# Altium schematic sheet Chip_Socket_Programmer-X01.SchDoc
size Letter; SheetNumber: 1; SheetTotal: 1
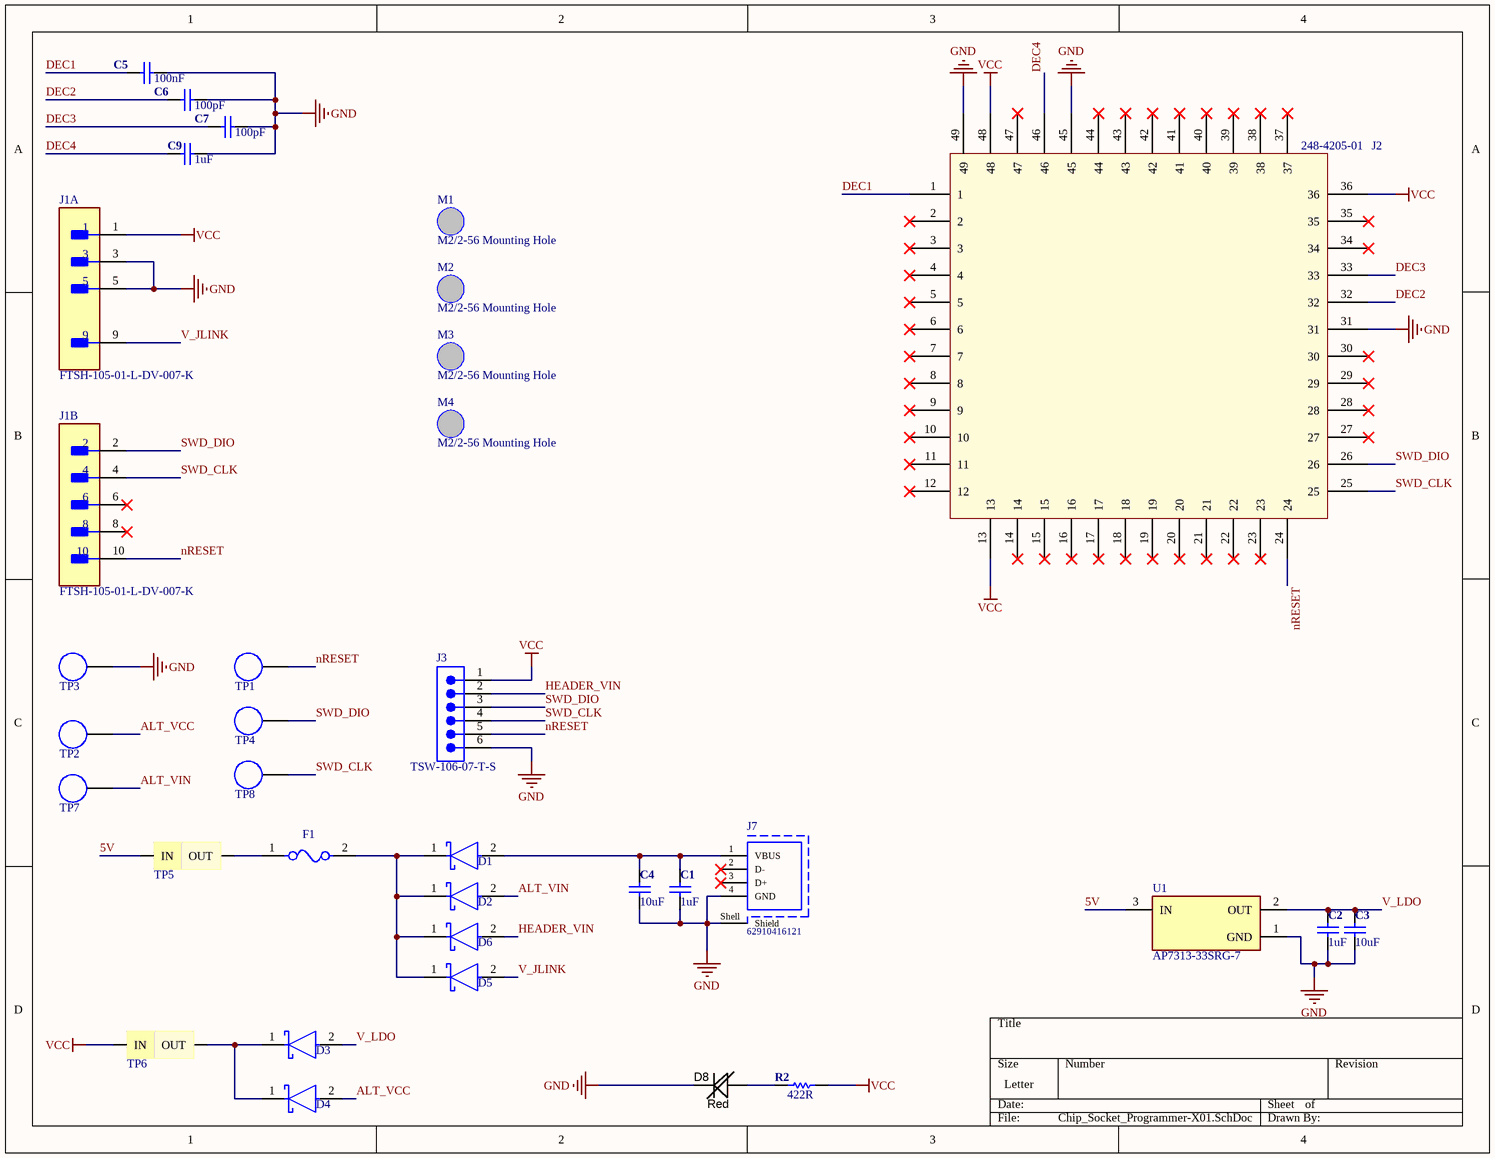
[diagram p0: Chip_Socket_Programmer-X01.SchDoc]

## Parts
C1  1uF  [C0402]
C2  1uF  [C0402]
C3  10uF  [C0402]
C4  10uF  [C0402]
C5  100nF  [C0402]
C6  100pF  [C0402]
C7  100pF  [C0402]
C9  1uF  [C0402]
D1  BAS140WE6327HTSA1  [FP-PG-SOD323-2-MFG]  (value not drawn)
D2  BAS140WE6327HTSA1  [FP-PG-SOD323-2-MFG]  (value not drawn)
D3  BAS140WE6327HTSA1  [FP-PG-SOD323-2-MFG]  (value not drawn)
D4  BAS140WE6327HTSA1  [FP-PG-SOD323-2-MFG]  (value not drawn)
D5  BAS140WE6327HTSA1  [FP-PG-SOD323-2-MFG]  (value not drawn)
D6  BAS140WE6327HTSA1  [FP-PG-SOD323-2-MFG]  (value not drawn)
D8  Red  [LED_0402]
F1  F0402G0R05FNTR  [FP-F0402G-MFG]  (value not drawn)
J1  FTSH-105-01-L-DV-007-K  [FTSH-105-01-L-DV-007-K]  (parts A,B of 2)
J2  248-4205-01  [248-4205-01]
J3  TSW-106-07-T-S  [SMTC-TSW-106-07-X-S]
J7  62910416121  [62910416121]
M1  M2/2-56 Mounting Hole  [Mounting Hole]
M2  M2/2-56 Mounting Hole  [Mounting Hole]
M3  M2/2-56 Mounting Hole  [Mounting Hole]
M4  M2/2-56 Mounting Hole  [Mounting Hole]
R2  422R  [R0402]
TP1  S1751-46R  [S1751-46R]  (value not drawn)
TP2  S1751-46R  [S1751-46R]  (value not drawn)
TP3  S1751-46R  [S1751-46R]  (value not drawn)
TP4  S1751-46R  [S1751-46R]  (value not drawn)
TP5  JUMPER  [JUMPER]  (value not drawn)
TP6  JUMPER  [JUMPER]  (value not drawn)
TP7  S1751-46R  [S1751-46R]  (value not drawn)
TP8  S1751-46R  [S1751-46R]  (value not drawn)
U1  AP7313-33SRG-7  [FP-SOT23-IPC_A]

## Nets
GND: C1.2 C2.2 C3.2 C4.2 C5.2 C6.2 C7.2 C9.1 D8.K J1.3 J1.5 J2.31 J2.45 J2.49 J3.6 J7.4(GND) J7.Shell(Shield) TP3.1 U1.1(GND)
VCC: J1.1 J2.13 J2.36 J2.48 J3.1 R2.1 TP6.1(IN)
5V: TP5.1(IN) U1.3(IN)
ALT_VCC: D4.2(A) TP2.1
ALT_VIN: D2.2(A) TP7.1
DEC1: C5.1 J2.1
DEC2: C6.1 J2.32
DEC3: C7.1 J2.33
DEC4: C9.2 J2.46
HEADER_VIN: D6.2(A) J3.2
nRESET: J1.10 J2.24 J3.5 TP1.1
SWD_CLK: J1.4 J2.25 J3.4 TP8.1
SWD_DIO: J1.2 J2.26 J3.3 TP4.1
V_JLINK: D5.2(A) J1.9
V_LDO: C2.1 C3.1 D3.2(A) U1.2(OUT)
NetC1_1: C1.1 C4.1 D1.2(A) J7.1(VBUS)
NetD1_1: D1.1(C) D2.1(C) D5.1(C) D6.1(C) F1.2
NetD3_1: D3.1(C) D4.1(C) TP6.2(OUT)
NetD8_A: D8.A R2.2
NetF1_1: F1.1 TP5.2(OUT)

Not connected (* = marked no-connect by the designer): J1 6* 8*; J2 2* 3* 4* 5* 6* 7* 8* 9* 10* 11* 12* 14* 15* 16* 17* 18* 19* 20* 21* 22* 23* 27* 28* 29* 30* 34* 35* 37* 38* 39* 40* 41* 42* 43* 44* 47*; J7 2(D-)* 3(D+)*

## Library data of the parts
C1 C2 C9 = C-0402(1005): Ceramic Capacitor, Multilayer, Ceramic, 6.3V, 20% +Tol, 20% -Tol, X5R, 15% TC, 1uF, Surface Mount, 0402; Manufacturer: Yageo; Manufacturer Part Number: CC0402MRX5R5BB105; Dissipation Factor: 10%; ComponentLink1URL: https://datasheet.ciiva.com/169/product-169683.pdf; ComponentLink1Description: https://datasheet.ciiva.com/169/product-169683.pdf; Supplier 1: Digi-Key; Supplier Part Number 1: 311-1441-1-ND; RoHS: Yes; Category: Ceramic Capacitors; Stock 1: 16697; Pricing 1: 1=0.13000, 10=0.08900, 100=0.04200, 500=0.02946, 1000=0.02439, 2500=0.02270, 5000=0.02076 (USD); Mount: Surface Mount; Case/Package: 0402; Number of Pins: 2; Case Code (Imperial): 0402; Case Code (Metric): 1005; Min Operating Temperature: -55°C; Max Operating Temperature: 85°C; Capacitance: 1uF; Tolerance: 20%; Voltage Rating: 6.3V; Voltage Rating (DC): 6.3V; Packaging: Tape and Reel; Package Quantity: 1; Dielectric: X5R; Termination: SMD/SMT; Composition: Ceramic; Length: 1mm; Height: 0.5mm; Width: 0.5mm; Thickness: 0.022inch; Depth: 0.5mm; Lead Free: Lead Free; Halogen Free: Halogen Free; ComponentLink2URL: https://datasheet.ciiva.com:443/pdfs/VipMasterIC/IC/YAGO/YAGO-S-A0006851646/YAGO-S-A0006851646-1.pdf?src-supplier=IHS+Markit; ComponentLink2Description: https://datasheet.ciiva.com:443/pdfs/VipMasterIC/IC/YAGO/YAGO-S-A0006851646/YAGO-S-A0006851646-1.pdf?src-supplier=IHS+Markit; ComponentLink3URL: https://datasheet.ciiva.com/176/mlccorderingcode-176806.pdf?src-supplier=Digi-Key; ComponentLink3Description: https://datasheet.ciiva.com/176/mlccorderingcode-176806.pdf?src-supplier=Digi-Key; ComponentLink4URL: https://datasheet.ciiva.com/176/mlccorderingcode-176807.pdf?src-supplier=Digi-Key; ComponentLink4Description: https://datasheet.ciiva.com/176/mlccorderingcode-176807.pdf?src-supplier=Digi-Key; ComponentLink5URL: https://datasheet.ciiva.com/176/mlccorderingcode-176808.pdf?src-supplier=Digi-Key; ComponentLink5Description: https://datasheet.ciiva.com/176/mlccorderingcode-176808.pdf?src-supplier=Digi-Key
C3 C4 = C-0402(1005): Ceramic Capacitor, Multilayer, Ceramic, 10V, 20% +Tol, 20% -Tol, X5R, 15% TC, 10uF, Surface Mount, 0402; Manufacturer: Kyocera AVX; Manufacturer Part Number: 0402ZD106MAT2A; Multilayer: Yes; Supplier 1: Digi-Key; Supplier Part Number 1: 478-10052-1-ND; RoHS: Yes; Category: Ceramic Capacitors; Stock 1: 113474; Pricing 1: 1=0.54000, 10=0.37400, 50=0.26160, 100=0.22420, 500=0.16818, 1000=0.14202, 2500=0.13455, 5000=0.12708 (USD); Mount: Surface Mount; Number of Pins: 2; Dielectric Material: Ceramic; Package Shape: Rectangular; Size Code: 0402; Terminal Finish: Nickel; Min Operating Temperature: -55°C; Max Operating Temperature: 85°C; JESD-609 Code: e3; Capacitance: 10uF; Capacitor Type: Ceramic; Negative Tolerance: 20%; Packaging: Tape and Reel; Positive Tolerance: 20%; Rated DC Voltage (URdc): 10V; Temperature Characteristics Code: X5R; Termination: Wraparound; REACH SVHC: Yes; RoHS Compliant: Yes; ComponentLink1URL: https://datasheet.ciiva.com:443/pdfs/VipMasterIC/IC/AVXC/AVXC-S-A0009640604/AVXC-S-A0009640604-1.pdf?src-supplier=IHS+Markit; ComponentLink1Description: https://datasheet.ciiva.com:443/pdfs/VipMasterIC/IC/AVXC/AVXC-S-A0009640604/AVXC-S-A0009640604-1.pdf?src-supplier=IHS+Markit; ComponentLink2URL: http://catalogs.avx.com/SurfaceMount.pdf?src-supplier=Digi-Key; ComponentLink2Description: http://catalogs.avx.com/SurfaceMount.pdf?src-supplier=Digi-Key; ComponentLink3URL: http://datasheets.avx.com/cx5r.pdf?src-supplier=Digi-Key; ComponentLink3Description: http://datasheets.avx.com/cx5r.pdf?src-supplier=Digi-Key; ComponentLink4URL: https://www.farnell.com/datasheets/2260752.pdf?src-supplier=Newark; ComponentLink4Description: https://www.farnell.com/datasheets/2260752.pdf?src-supplier=Newark
C5 = C-0402(1005): Ceramic Capacitor, Multilayer, Ceramic, 25V, 10% +Tol, 10% -Tol, X5R, 15% TC, 0.1uF, Surface Mount, 0402; Manufacturer: Taiyo Yuden; Manufacturer Part Number: TMK105BJ104KV-F; ComponentLink1URL: https://datasheet.ciiva.com/169/product-169683.pdf; ComponentLink1Description: https://datasheet.ciiva.com/169/product-169683.pdf; Supplier 1: Digi-Key; Supplier Part Number 1: 587-1456-1-ND; RoHS: Yes; Category: Ceramic Capacitors; Stock 1: 27456801; Pricing 1: 1=0.10000, 10=0.04600, 100=0.02050, 500=0.01464, 1000=0.01150, 2500=0.01045, 5000=0.00961 (USD); Mount: Surface Mount; Case/Package: 0402; Number of Pins: 2; Weight: 2.3E-05oz; Case Code (Imperial): 0402; Case Code (Metric): 1005; Min Operating Temperature: -55°C; Max Operating Temperature: 85°C; Capacitance: 100nF; Tolerance: 10%; Packaging: Tape and Reel; Dielectric: X5R; Voltage Rating (DC): 25V; Voltage Rating: 25V; Package Quantity: 1; Termination: SMD/SMT; Composition: Ceramic; Voltage: 25V; Length: 1mm; Height: 0.5mm; Width: 0.5mm; Depth: 0.5mm; Thickness: 0.022inch; REACH SVHC: No SVHC; Lead Free: Lead Free; Halogen Free: Halogen Free; ComponentLink2URL: https://datasheet.ciiva.com:443/pdfs/VipMasterIC/IC/TAIY/TAIY-S-A0009103435/TAIY-S-A0009103038-1.pdf?src-supplier=IHS+Markit; ComponentLink2Description: https://datasheet.ciiva.com:443/pdfs/VipMasterIC/IC/TAIY/TAIY-S-A0009103435/TAIY-S-A0009103038-1.pdf?src-supplier=IHS+Markit; ComponentLink3URL: https://datasheet.ciiva.com/30051/25tmk105bj104kv-f-30051094.pdf?src-supplier=Onlinecomponents.com; ComponentLink3Description: https://datasheet.ciiva.com/30051/25tmk105bj104kv-f-30051094.pdf?src-supplier=Onlinecomponents.com; ComponentLink4URL: https://datasheet.ciiva.com/15922/28tmk105bj104kv-f-15922315.pdf?src-supplier=Onlinecomponents.com; ComponentLink4Description: https://datasheet.ciiva.com/15922/28tmk105bj104kv-f-15922315.pdf?src-supplier=Onlinecomponents.com; ComponentLink5URL: https://datasheet.ciiva.com/131/tmk105bj104kv-f-ss-131420.pdf?src-supplier=Digi-Key; ComponentLink5Description: https://datasheet.ciiva.com/131/tmk105bj104kv-f-ss-131420.pdf?src-supplier=Digi-Key; ComponentLink6URL: https://datasheet.ciiva.com/22768/1693457-22768649.pdf?src-supplier=Farnell; ComponentLink6Description: https://datasheet.ciiva.com/22768/1693457-22768649.pdf?src-supplier=Farnell
C6 C7 = C-0402(1005): Ceramic Capacitor, Multilayer, Ceramic, 50V, 1% +Tol, 1% -Tol, C0G, 30ppm/Cel TC, 0.0001uF, Surface Mount, 0402; Manufacturer: Yageo; Manufacturer Part Number: CC0402FRNPO9BN101; ComponentLink1URL: https://datasheet.ciiva.com/169/product-169683.pdf; ComponentLink1Description: https://datasheet.ciiva.com/169/product-169683.pdf; Supplier 1: Digi-Key; Supplier Part Number 1: 311-3329-1-ND; RoHS: Yes; Category: Ceramic Capacitors; Stock 1: 22812; Pricing 1: 1=0.11000, 10=0.08200, 100=0.03840, 500=0.02690, 1000=0.02228, 2500=0.02073, 5000=0.01897 (USD); Mount: Surface Mount; Case/Package: 0402; Case Code (Imperial): 0402; Case Code (Metric): 1005; Min Operating Temperature: -55°C; Max Operating Temperature: 125°C; Package Quantity: 10000; Voltage Rating (DC): 50V; Dielectric: C0G; Termination: SMD/SMT; Composition: Ceramic; Packaging: Tape and Reel; Capacitance: 100pF; Tolerance: 1%; Voltage Rating: 50V; Length: 1mm; Width: 0.02inch; Thickness: 0.022inch; Depth: 0.5mm; Lead Free: Lead Free; ComponentLink2URL: https://datasheet.ciiva.com:443/pdfs/VipMasterIC/IC/YAGO/YAGO-S-A0009251638/YAGO-S-A0009251638-1.pdf?src-supplier=IHS+Markit; ComponentLink2Description: https://datasheet.ciiva.com:443/pdfs/VipMasterIC/IC/YAGO/YAGO-S-A0009251638/YAGO-S-A0009251638-1.pdf?src-supplier=IHS+Markit; ComponentLink3URL: http://www.mouser.com/ds/2/447/Yageo_UPY-GP_NP0_16V-to-50V_9-358835.pdf?src-supplier=Mouser; ComponentLink3Description: http://www.mouser.com/ds/2/447/Yageo_UPY-GP_NP0_16V-to-50V_9-358835.pdf?src-supplier=Mouser; ComponentLink4URL: http://components.arrow.com/part/dataview/0323_00775990?src-supplier=Arrow+Europe; ComponentLink4Description: http://components.arrow.com/part/dataview/0323_00775990?src-supplier=Arrow+Europe; ComponentLink5URL: http://www.yageo.com/NewPortal/yageodocoutput?fileName=/pdf/MLCC/UPY-GP_NP0_16V-to-50V_14.pdf&src-supplier=Digi-Key; ComponentLink5Description: http://www.yageo.com/NewPortal/yageodocoutput?fileName=/pdf/MLCC/UPY-GP_NP0_16V-to-50V_14.pdf&src-supplier=Digi-Key; ComponentLink6URL: http://www.yageo.com/documents/recent/UPY-GP_NP0_16V-to-50V_16.pdf?src-supplier=Digi-Key; ComponentLink6Description: http://www.yageo.com/documents/recent/UPY-GP_NP0_16V-to-50V_16.pdf?src-supplier=Digi-Key; ComponentLink7URL: http://www.yageo.com/documents/recent/UPY-GP_NP0_16V-to-50V_9.pdf?src-supplier=Future+Electronics; ComponentLink7Description: http://www.yageo.com/documents/recent/UPY-GP_NP0_16V-to-50V_9.pdf?src-supplier=Future+Electronics
D1-D6 = CMP-32890-000002-1: DIODE SCHOTTKY 40V 120MA SOD323; Manufacturer: Infineon; Peak Non-Repetitive Surge Current: 200mA; Forward Voltage: 1V; Reverse Recovery Time: 100ps; Element Configuration: Single; Diode Element Material: SILICON; Package Body Material: Plastic; Diode Type: RECTIFIER; Number of Elements: 1; Max Power Dissipation: 250mW; Qualification Status: Not Qualified; Min Operating Temperature: -55°C; Average Rectified Current: 120mA; Halogen Free: Not Halogen Free; Mount: Surface Mount; Max Reverse Voltage (DC): 40V; Case/Package: SOD-323-2; Packaging: Tape and Reel; Lead Free: Lead Free; Radiation Hardening: No; Number of Pins: 2; Forward Current: 120mA; Max Operating Temperature: 125°C; Max Repetitive Reverse Voltage (Vrrm): 40V; Supplier 1: Digi-Key; Supplier Part Number 1: BAS140WE6327HTSA1CT-ND; Manufacturer Part Number: BAS140WE6327HTSA1; RoHS: Yes; Category: Rectifier Diodes; Stock 1: 1828; Pricing 1: 1=0.55000, 10=0.41300, 100=0.25740, 500=0.17612, 1000=0.13547 (USD); Package Shape: Rectangular; Terminal Finish: Tin; JESD-609 Code: e3; JESD-30 Code: R-PDSO-G2; Moisture Sensitivity Level: 1; Package Style: SMALL OUTLINEMeter; Surface Mount: Yes; Technology: SCHOTTKY; Terminal Form: Gull Wing; Terminal Position: DUAL; Max Output Current: 120mA; REACH SVHC: Yes; RoHS Compliant: Yes; ComponentLink1URL: https://datasheet.ciiva.com:443/pdfs/VipMasterIC/IC/INFN/INFNS11688/INFNS11688-1.pdf?src-supplier=IHS+Markit; ComponentLink1Description: https://datasheet.ciiva.com:443/pdfs/VipMasterIC/IC/INFN/INFNS11688/INFNS11688-1.pdf?src-supplier=IHS+Markit; ComponentLink2URL: https://datasheet.ciiva.com/26851/getdatasheetpartid-730941-26851022.pdf?src-supplier=Verical; ComponentLink2Description: https://datasheet.ciiva.com/26851/getdatasheetpartid-730941-26851022.pdf?src-supplier=Verical; ComponentLink3URL: https://datasheet.ciiva.com/8303/infineon-bas40-bas140series-ds-v01-01-en-8303321.pdf?src-supplier=Avnet; ComponentLink3Description: https://datasheet.ciiva.com/8303/infineon-bas40-bas140series-ds-v01-01-en-8303321.pdf?src-supplier=Avnet
D8 = LED_0402(1005): Single Color LED, Hyper Red, Water Clear, 0.8mm; Manufacturer: Kingbright; Manufacturer Part Number: APHHS1005SURCK; Forward Current: 20mA; Forward Voltage: 1.95V; Luminous Intensity: 220mcd; Viewing Angle: 120°; Wavelength: 635nm; Lens Style: Clear,Flat; Dominant Wavelength: 630nm; Number of LEDs: 1; Supplier 1: Digi-Key; Supplier Part Number 1: 754-1104-1-ND; RoHS: Yes; Category: LEDs; Stock 1: 12156; Pricing 1: 1=0.50000, 10=0.35400, 100=0.20650, 500=0.14160, 1000=0.11800 (USD); Mount: Surface Mount; Case/Package: 0402; Number of Pins: 2; Color: Red; Case Code (Metric): 1005; Case Code (Imperial): 0402; Lens Color: Clear; Min Operating Temperature: -40°C; Max Operating Temperature: 85°C; Packaging: Tape and Reel; Package Quantity: 2000; Illumination Color: Red; Test Current: 20mA; Length: 1mm; Height: 0.6mm; Width: 0.5mm; Lead Free: Lead Free; ComponentLink1URL: https://datasheet.ciiva.com:443/pdfs/VipMasterIC/IC/KBEC/KBEC-S-A0008947180/KBEC-S-A0008958151-1.pdf?src-supplier=IHS+Markit; ComponentLink1Description: https://datasheet.ciiva.com:443/pdfs/VipMasterIC/IC/KBEC/KBEC-S-A0008947180/KBEC-S-A0008958151-1.pdf?src-supplier=IHS+Markit; ComponentLink2URL: https://datasheet.ciiva.com/4689/aphhs1005surck-32322-4689068.pdf?src-supplier=Mouser; ComponentLink2Description: https://datasheet.ciiva.com/4689/aphhs1005surck-32322-4689068.pdf?src-supplier=Mouser; ComponentLink3URL: https://datasheet.ciiva.com/2114/aphhs1005surck-2114140.pdf?src-supplier=Digi-Key; ComponentLink3Description: https://datasheet.ciiva.com/2114/aphhs1005surck-2114140.pdf?src-supplier=Digi-Key; ComponentLink4URL: https://datasheet.ciiva.com/14603/70062833-14603899.pdf?src-supplier=Allied+Electronics; ComponentLink4Description: https://datasheet.ciiva.com/14603/70062833-14603899.pdf?src-supplier=Allied+Electronics; ComponentLink5URL: https://datasheet.ciiva.com/2114/aphhs1005surck-2114142.pdf?src-supplier=Digi-Key; ComponentLink5Description: https://datasheet.ciiva.com/2114/aphhs1005surck-2114142.pdf?src-supplier=Digi-Key; ComponentLink6URL: https://datasheet.ciiva.com/2114/aphhs1005surck-2114141.pdf?src-supplier=Digi-Key; ComponentLink6Description: https://datasheet.ciiva.com/2114/aphhs1005surck-2114141.pdf?src-supplier=Digi-Key
F1 = CMP-04585-000002-1: FUSE BOARD MOUNT 50MA 32VDC 0402; Manufacturer: AVX Corporation; Fuse Blow Speed: Fast; Resistance: 3.4Ω; Value: 3.4Ω; Voltage Rating: 32V; Fuse Voltage Drop: 250mV; Circuit Protection Type: Electric Fuse; Joule-integral-Nom: 0J; Lead Free: Yes; Fuse Current: 50mA; Device Class L2: Fuses; ComponentLink2URL: http://datasheets.avx.com/AccuGuardLC_0402.pdf; Automotive: No; Digikey Description: FUSE BOARD MOUNT 50MA 32VDC 0402; Temperature Range Low: -55°C; Device Class L1: Circuit Protection; Octopart: https://octopart.com/f0402g0r05fntr-avx-19631750; ComponentLink2Description: Datasheet; Mouser Description: Surface Mount Fuses 0402 50mA fuse; Device Class L3: unset; Temperature Range High: +125°C; Manufacturer Part Number: F0402G0R05FNTR; Height: 0.4mm; Package: F0402G; RoHS: TRUE; Temperature: -55°C to +125°C; Category: Fuse; Supplier 1: Digi-Key; Supplier Part Number 1: 478-6482-1-ND; Stock 1: 222662; Pricing 1: 1=0.80000, 5=0.78000, 10=0.75600, 50=0.63600, 100=0.52800, 250=0.48000, 500=0.40800, 1000=0.36000 (USD); Mount: Surface Mount; Terminal Finish: Nickel; Min Operating Temperature: -55°C; Max Operating Temperature: 125°C; Current Rating: 50mA; Voltage Rating (AC): 32V; Voltage Rating (DC): 32V; JESD-609 Code: e3; REACH SVHC: Yes; RoHS Compliant: Yes; ComponentLink1URL: https://datasheet.ciiva.com:443/pdfs/VipMasterIC/IC/AVXC/AVXCS07889/AVXCS07889-1.pdf?src-supplier=IHS+Markit; ComponentLink1Description: https://datasheet.ciiva.com:443/pdfs/VipMasterIC/IC/AVXC/AVXCS07889/AVXCS07889-1.pdf?src-supplier=IHS+Markit; ComponentLink3URL: https://datasheet.ciiva.com/4485/accug2minilc-38833-4485751.pdf?src-supplier=Mouser; ComponentLink3Description: https://datasheet.ciiva.com/4485/accug2minilc-38833-4485751.pdf?src-supplier=Mouser; ComponentLink4URL: https://datasheet.ciiva.com/301/accug2minilc-301366.pdf?src-supplier=Digi-Key; ComponentLink4Description: https://datasheet.ciiva.com/301/accug2minilc-301366.pdf?src-supplier=Digi-Key; ComponentLink5URL: https://datasheet.ciiva.com/301/accug2minilc-301367.pdf?src-supplier=Digi-Key; ComponentLink5Description: https://datasheet.ciiva.com/301/accug2minilc-301367.pdf?src-supplier=Digi-Key; ComponentLink6URL: https://datasheet.ciiva.com/301/accug2minilc-301368.pdf?src-supplier=Digi-Key; ComponentLink6Description: https://datasheet.ciiva.com/301/accug2minilc-301368.pdf?src-supplier=Digi-Key; ComponentLink7URL: https://datasheet.ciiva.com/17417/accug2minilc-17417929.pdf?src-supplier=Avnet+Europe; ComponentLink7Description: https://datasheet.ciiva.com/17417/accug2minilc-17417929.pdf?src-supplier=Avnet+Europe; ComponentLink8URL: https://datasheet.ciiva.com/3017/accug2minilc-3017725.pdf?src-supplier=Avnet; ComponentLink8Description: https://datasheet.ciiva.com/3017/accug2minilc-3017725.pdf?src-supplier=Avnet
J1 = 7c368be3265735b2816d0cab4417f87: CONN HEADER SMD 10POS 1.27MM; Manufacturer: Samtec; Connector Type: Male Pin; Number of Positions: 10; Number of Positions Loaded: 9; Current Rating: 3.4A; Supplier 1: Digi-Key; Supplier Part Number 1: SAM9438-ND; Manufacturer Part Number: FTSH-105-01-L-DV-007-K; RoHS: No; Category: Headers and Wire Housings; Pricing 1: 1=3.43000, 10=3.28800, 100=2.74000, 500=2.32900, 1000=1.98650, 5000=1.78100 (USD); Mount: Surface Mount; Number of Pins: 10; Contact Plating: Gold; Contact Material: Bronze; Contact Shape: Square; Insulation Material: Polymer; Insulation Color: Black; Min Operating Temperature: -55°C; Max Operating Temperature: 125°C; Fastening Type: Push,Pull; Packaging: Rail/Tube; Number of Rows: 2; Termination: Solder; Flammability Rating: UL94 V-0; ComponentLink1URL: https://datasheet.ciiva.com:443/pdfs/VipMasterIC/IC/SAMI/SAMI-S-A0006911451/SAMI-S-A0006911451-1.pdf?src-supplier=IHS+Markit; ComponentLink1Description: https://datasheet.ciiva.com:443/pdfs/VipMasterIC/IC/SAMI/SAMI-S-A0006911451/SAMI-S-A0006911451-1.pdf?src-supplier=IHS+Markit; ComponentLink2URL: http://www.farnell.com/datasheets/2570365.pdf?src-supplier=Farnell; ComponentLink2Description: http://www.farnell.com/datasheets/2570365.pdf?src-supplier=Farnell; ComponentLink3URL: http://suddendocs.samtec.com/prints/ftsh-1xx-xx-xxx-dv-xxx-xxx-mkt.pdf?src-supplier=Digi-Key; ComponentLink3Description: http://suddendocs.samtec.com/prints/ftsh-1xx-xx-xxx-dv-xxx-xxx-mkt.pdf?src-supplier=Digi-Key; ComponentLink4URL: http://www.farnell.com/datasheets/2570365.pdf?src-supplier=Element14; ComponentLink4Description: http://www.farnell.com/datasheets/2570365.pdf?src-supplier=Element14; ComponentLink5URL: http://www.farnell.com/datasheets/2570365.pdf?src-supplier=Newark; ComponentLink5Description: http://www.farnell.com/datasheets/2570365.pdf?src-supplier=Newark
J2 = 248-4205-01: IC Socket; Manufacturer: 3M; Supplier 1: Digi-Key; Supplier Part Number 1: 3M10836-ND; Manufacturer Part Number: 248-4205-01; RoHS: Yes; Category: IC and Component Sockets; Stock 1: 14; Pricing 1: 1=116.49000, 10=109.64200, 25=106.21520, 50=99.36260, 100=93.88060 (USD); Contact Finish - Mating: NOT SPECIFIED; Device Socket Type: IC SOCKET; REACH SVHC: No SVHC; RoHS Compliant: Yes; ComponentLink1URL: https://datasheet.ciiva.com:443/pdfs/VipMasterIC/IC/IIIM/IIIMS02795/IIIMS02795-1.pdf?src-supplier=IHS+Markit; ComponentLink1Description: https://datasheet.ciiva.com:443/pdfs/VipMasterIC/IC/IIIM/IIIMS02795/IIIMS02795-1.pdf?src-supplier=IHS+Markit; ComponentLink2URL: https://datasheet.ciiva.com/6783/cd2451-6783172.pdf?src-supplier=Digi-Key; ComponentLink2Description: https://datasheet.ciiva.com/6783/cd2451-6783172.pdf?src-supplier=Digi-Key; ComponentLink3URL: https://datasheet.ciiva.com/12084/cd2451-52150-12084009.pdf?src-supplier=Mouser; ComponentLink3Description: https://datasheet.ciiva.com/12084/cd2451-52150-12084009.pdf?src-supplier=Mouser; ComponentLink4URL: https://datasheet.ciiva.com/1102/cd2451-1102403.pdf?src-supplier=Newark; ComponentLink4Description: https://datasheet.ciiva.com/1102/cd2451-1102403.pdf?src-supplier=Newark; ComponentLink5URL: https://datasheet.ciiva.com/8006/cd2451-8006713.pdf?src-supplier=Element14; ComponentLink5Description: https://datasheet.ciiva.com/8006/cd2451-8006713.pdf?src-supplier=Element14
J3 = CMP-1024-00384-1: 0.025" SQ Post Header, Through-hole, Vertical, -55 to 105 degC, 2.54 mm Pitch, 6-Pin, Male, RoHS; Manufacturer: Samtec; Pitch: 2.54 mm; ComponentLink3URL: http://www.samtec.com/documents/webfiles/cpdf/TSW-XXX-XX-XXX-X-XX-XXX-MKT.pdf; ComponentLink1Description: Manufacturer URL; Orientation: Vertical; ComponentLink2Description: Datasheet; ComponentLink1URL: http://www.samtec.com; RoHS: True; DatasheetVersion: F-214; PackageDescription: .025[0.64] SQ. Post Terminal Strip Assembly; PartNumber: TSW-106-07-T-S; Mounting Technology: Through-hole; PackageReference: TSW-106-07-X-S; PackageVersion: DM, 8/1988; ComponentLink3Description: Package Specification; ComponentLink2URL: http://www.samtec.com/documents/webfiles/pdf/TSW_TH.PDF; Temperature Range: -55 to 105 degC
J7 = CMP-1502-03244-1: USB 2.0 Type B Receptacle WR-COM, Horizontal, SMT, with Pads and Pegs; Manufacturer: Wurth Electronics; Number of Contacts: 4; USB Standard: USB 2.0; Number of Ports: 1; Current Rating: 1.5A; Mating Cycles: 1500; Shielding: Shielded; Supplier 1: Digi-Key; Supplier Part Number 1: 732-3152-1-ND; Manufacturer Part Number: 62910416121; RoHS: Yes; Category: Connectors; Stock 1: 80; Pricing 1: 1=3.83000, 10=3.76300, 50=3.49400, 100=3.22600 (USD); Mount: Surface Mount; Contact Plating: Gold; Contact Material: Copper Alloy; Insulation Color: Black; Min Operating Temperature: -40°C; Max Operating Temperature: 105°C; Package Quantity: 150; Packaging: Tape and Reel; Gender: Receptacle; Connector Type: USB; Termination: Solder; Orientation: Right Angle; Features: Shielded; Length: 16mm; REACH SVHC: Unknown; Lead Free: Lead Free; Flammability Rating: UL94 V-0; ComponentLink1URL: https://datasheet.ciiva.com:443/pdfs/VipMasterIC/IC/MIDC/MIDC-S-A0004022663/MIDC-S-A0003061583-1.pdf?src-supplier=IHS+Markit; ComponentLink1Description: https://datasheet.ciiva.com:443/pdfs/VipMasterIC/IC/MIDC/MIDC-S-A0004022663/MIDC-S-A0003061583-1.pdf?src-supplier=IHS+Markit; ComponentLink2URL: https://datasheet.ciiva.com/851/62910416121-851244.pdf?src-supplier=Digi-Key; ComponentLink2Description: https://datasheet.ciiva.com/851/62910416121-851244.pdf?src-supplier=Digi-Key; ComponentLink3URL: https://datasheet.ciiva.com/851/62910416121-851245.pdf?src-supplier=Digi-Key; ComponentLink3Description: https://datasheet.ciiva.com/851/62910416121-851245.pdf?src-supplier=Digi-Key; ComponentLink4URL: https://datasheet.ciiva.com/851/62910416121-851246.pdf?src-supplier=Digi-Key; ComponentLink4Description: https://datasheet.ciiva.com/851/62910416121-851246.pdf?src-supplier=Digi-Key
R2 = R-0402(1005): Fixed Resistor, Thin Film, 0.0625W, 422ohm, 50V, 0.1% +/-Tol, 25ppm/Cel, Surface Mount, 0402; Manufacturer: Yageo; Manufacturer Part Number: RT0402BRD07422RL; Power Rating: 62.5mW; Temperature Coefficient: 25ppm/°C; Supplier 1: Digi-Key; Supplier Part Number 1: YAG4263CT-ND; RoHS: Yes; Category: Chip SMD Resistors; Stock 1: 9302; Pricing 1: 1=0.39000, 10=0.27800, 100=0.11140, 1000=0.05488, 2500=0.05084, 5000=0.04600 (USD); Case/Package: 0402; Case Code (Metric): 1005; Case Code (Imperial): 0402; Min Operating Temperature: -55°C; Max Operating Temperature: 125°C; Voltage Rating: 50V; Resistance: 422R; Tolerance: 0.1%; Packaging: Tape and Reel; Termination: SMD/SMT; Voltage Rating (DC): 50V; Length: 1mm; Height: 350um; Width: 500um; Lead Free: Lead Free; ComponentLink1URL: https://datasheet.ciiva.com:443/pdfs/VipMasterIC/IC/YAGO/YAGO-S-A0008510989/YAGO-S-A0008510989-1.pdf?src-supplier=IHS+Markit; ComponentLink1Description: https://datasheet.ciiva.com:443/pdfs/VipMasterIC/IC/YAGO/YAGO-S-A0008510989/YAGO-S-A0008510989-1.pdf?src-supplier=IHS+Markit; ComponentLink2URL: https://datasheet.ciiva.com/12705/pyu-rt-1-to-0-05-rohs-l-4-12705867.pdf?src-supplier=Mouser; ComponentLink2Description: https://datasheet.ciiva.com/12705/pyu-rt-1-to-0-05-rohs-l-4-12705867.pdf?src-supplier=Mouser
TP1-TP4 TP7 TP8 = S1751-46R: PC TEST POINT TIN SMD; Manufacturer: Harwin Inc.; Supplier 1: Digi-Key; RoHS: RoHS Compliant; Stock 1: 275112; Pricing 1: 1=0.29, 10=0.272, 25=0.2324, 50=0.2032, 100=0.1888, 250=0.167, 500=0.15972, 1000=0.13068 (USD); Packaging: Cut Tape (CT); Type: PC Test Point; Terminal: 0.128" x 0.065" x 0.079" (3.25mm x 1.65mm x 2.00mm) Brass, Tin Plated; Mounting Type: Surface Mount; Material: Copper Alloy; Color: Natural; ComponentLink1URL: http://cdn.harwin.com/pdfs/S1751.pdf; ComponentLink1Description: http://cdn.harwin.com/pdfs/S1751.pdf; Supplier Part Number 1: 952-1478-1-ND; Manufacturer Part Number: S1751-46R; Category: Test and Measurement
TP5 TP6 = JUMPER: SHUNT LP W/HANDLE 2 POS 30AU; Manufacturer: TE Connectivity; Manufacturer Part Number: 8815452; Number of Contacts: 2; Contact Current Rating: 3A; Contact Resistance: 15mR; Gender: Female; Pitch: 2.54mm; Approvals: UL,CSA; Supplier 1: Digi-Key; Supplier Part Number 1: A26242-ND; RoHS: Yes; Category: Headers and Wire Housings; Stock 1: 2099; Pricing 1: 1=0.280000, 10=0.262000, 25=0.223600, 50=0.195600, 100=0.181700, 250=0.160760, 500=0.153760, 1000=0.125800, 2500=0.115320 (USD); Contact Plating: Gold; Housing Color: Black; Housing Material: Thermoplastic; Contact Material: Bronze; Color: Black; Min Operating Temperature: -65°C; Max Operating Temperature: 105°C; Number of Rows: 1; Package Quantity: 14000; Packaging: Bag; Orientation: Straight; Number of Positions: 2; Contact Gender: Female; Current Rating: 3A; Termination: Solder; Length: 5.08mm; Height: 10.9mm; Depth: 10.9mm; Width: 2.5mm; Radiation Hardening: No; Flammability Rating: UL94 V-0; REACH SVHC: No SVHC; ComponentLink1URL: https://datasheet.ciiva.com/1455/92946-1455888.pdf?src-supplier=Newark; ComponentLink1Description: https://datasheet.ciiva.com/1455/92946-1455888.pdf?src-supplier=Newark; ComponentLink2URL: https://datasheet.ciiva.com/19459/841467-19459897.pdf?src-supplier=Jameco; ComponentLink2Description: https://datasheet.ciiva.com/19459/841467-19459897.pdf?src-supplier=Jameco; ComponentLink3URL: https://datasheet.ciiva.com/15174/getdatasheetpartid-155768-15174939.pdf?src-supplier=Verical; ComponentLink3Description: https://datasheet.ciiva.com/15174/getdatasheetpartid-155768-15174939.pdf?src-supplier=Verical; ComponentLink4URL: https://datasheet.ciiva.com/11754/0900766b80da19e8-11754990.pdf?src-supplier=RSComponents; ComponentLink4Description: https://datasheet.ciiva.com/11754/0900766b80da19e8-11754990.pdf?src-supplier=RSComponents; ComponentLink5URL: https://datasheet.ciiva.com/30154/eng-cs-1307819-section-6-7and8-0808-30154293.pdf?src-supplier=Onlinecomponents.com; ComponentLink5Description: https://datasheet.ciiva.com/30154/eng-cs-1307819-section-6-7and8-0808-30154293.pdf?src-supplier=Onlinecomponents.com; ComponentLink6URL: https://datasheet.ciiva.com/767/eng-cd-881545-k3-767850.pdf?src-supplier=Digi-Key; ComponentLink6Description: https://datasheet.ciiva.com/767/eng-cd-881545-k3-767850.pdf?src-supplier=Digi-Key; ComponentLink7URL: https://datasheet.ciiva.com/3120/eng-cs-1307819-section-6-7and8-0808-3120202.pdf?src-supplier=Avnet; ComponentLink7Description: https://datasheet.ciiva.com/3120/eng-cs-1307819-section-6-7and8-0808-3120202.pdf?src-supplier=Avnet
U1 = CMP-12756-000034-1: IC REG LIN 3.3V 150MA SOT23R-3; Manufacturer: Diodes; Number of Outputs: 1; Accuracy: 2%; Dropout Voltage: 150mV; Max Input Voltage: 6V; Output Type: Fixed; Polarity: Positive; Min Current Limit: 200mA; Min Input Voltage: 2V; Max Power Dissipation: 600mW; Power Dissipation: 540W; Quiescent Current: 75uA; Package Body Material: Plastic; Output Voltage1-Max: 3.366V; Output Voltage1-Min: 3.234V; Regulator Type: FIXED POSITIVE SINGLE OUTPUT LDO REGULATOR; Dropout Voltage1-Max: 300mV; Time @ Peak Reflow Temperature-Max (s): 30s; Qualification Status: Not Qualified; Case/Package: TO-236-3; Weight: 0.000282oz; Lead Free: Lead Free; Width: 1.4mm; REACH SVHC: No SVHC; Height: 1mm; Min Operating Temperature: -40°C; Max Operating Temperature: 85°C; Radiation Hardening: No; Mount: Surface Mount; Packaging: Tape and Reel; Max Output Current: 150mA; Min Output Voltage: 3.3V; Length: 3mm; Number of Regulators: 1; Output Current: 150mA; Package Quantity: 3000; Number of Pins: 3; Output Voltage: 3.3V; Supplier 1: Digi-Key; Supplier Part Number 1: AP7313-33SRG-7DICT-ND; Manufacturer Part Number: AP7313-33SRG-7; RoHS: Yes; Category: Voltage Regulators - Linear; Stock 1: 6348; Pricing 1: 1=0.37000, 10=0.29900, 25=0.27360, 100=0.20350, 250=0.18444, 500=0.15264, 1000=0.11448 (USD); Package Code: LSSOP; Package Shape: Rectangular; Terminal Finish: Tin; JESD-609 Code: e3; Moisture Sensitivity Level: 1; Number of Functions: 1; Operating Temperature, TJ-Max: 125°C; Operating Temperature, TJ-Min: -40°C; Output Current1-Max: 150mA; Output Voltage1-Nom: 3.3V; Package Style: SMALL OUTLINE, LOW PROFILE, SHRINK PITCHMeter; Peak Reflow Temperature (Cel): 260°C; Surface Mount: Yes; Terminal Form: Gull Wing; Terminal Position: DUAL; JESD-30 Code: R-PDSO-G3; Height - Seated (Max): 1.35mm; Terminal Pitch: 0.96mm; RoHS Compliant: Yes; ComponentLink1URL: https://datasheet.ciiva.com:443/pdfs/VipMasterIC/IC/DIOD/DIODS11952/DIODS11952-1.pdf?src-supplier=IHS+Markit; ComponentLink1Description: https://datasheet.ciiva.com:443/pdfs/VipMasterIC/IC/DIOD/DIODS11952/DIODS11952-1.pdf?src-supplier=IHS+Markit; ComponentLink2URL: https://datasheet.ciiva.com/26856/getdatasheetpartid-656981-26856375.pdf?src-supplier=Verical; ComponentLink2Description: https://datasheet.ciiva.com/26856/getdatasheetpartid-656981-26856375.pdf?src-supplier=Verical; ComponentLink3URL: https://datasheet.ciiva.com/16415/ap7313-16415567.pdf?src-supplier=Future+Electronics; ComponentLink3Description: https://datasheet.ciiva.com/16415/ap7313-16415567.pdf?src-supplier=Future+Electronics